# Altium project gest.PrjPcb
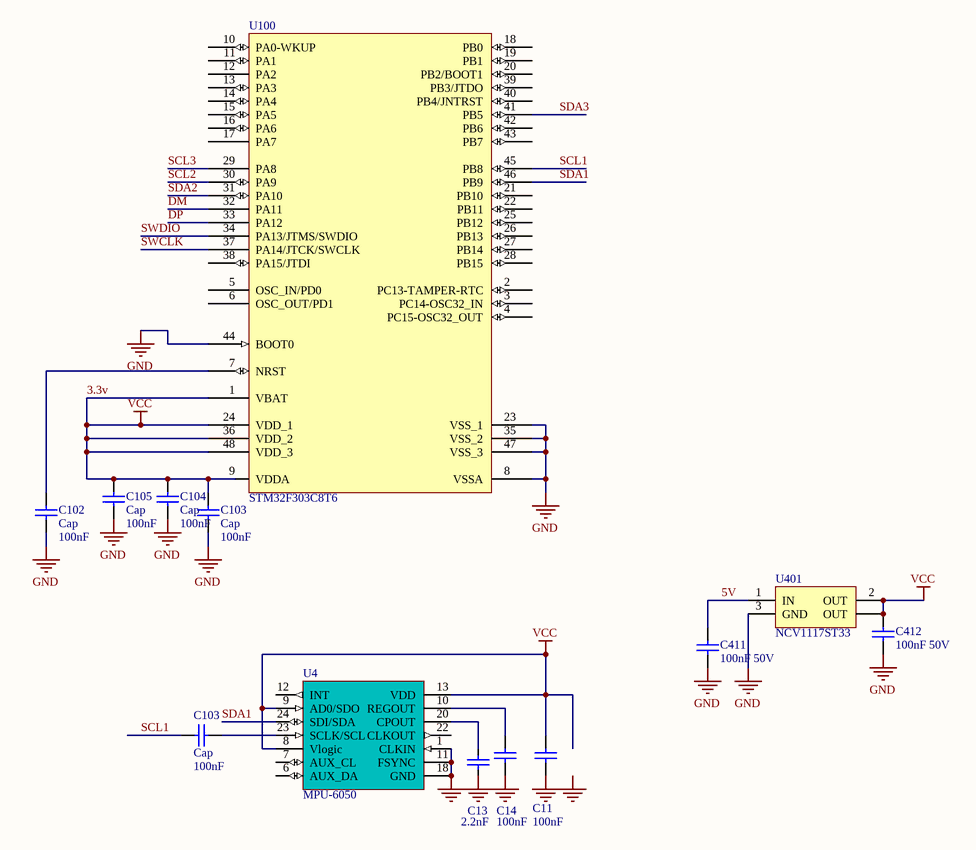
[diagram p0: gest.SchDoc]
1 sheet, 13 parts. Net scope: global (net labels, ports and power ports of the same name join across sheets).
Board file: gest.PcbDoc

## Sheet gest.SchDoc
size A4

### Parts
(Parts that share a designator on the sheet are numbered #1, #2 ... from top to bottom, then left to right.)
C11  value 100nF  [0402x]  (hidden comment: Cap402)
C13  value 2.2nF  [0402x]  (hidden comment: Cap603)
C14  value 100nF  [0603x]  (hidden comment: Cap402)
C102  Cap  value 100nF  [ERA-0603]
C103#1  Cap  value 100nF  [0603x]
C103#2  Cap  value 100nF  [0603x]
C104  Cap  value 100nF  [0603x]
C105  Cap  value 100nF  [0603x]
C411  100nF 50V  [0603x]
C412  100nF 50V  [0603x]
U4  MPU-6050  [IMU-3000]
U100  STM32F303C8T6  [LQFP48_N]
U401  NCV1117ST33  [sot23_l]

### Nets
3.3v: C11.2 C103#1.2 C104.2 C105.2 C412.1 U4.8(Vlogic) U4.9(AD0/SDO) U4.13(VDD) U100.1(VBAT) U100.9(VDDA) U100.24(VDD_1) U100.36(VDD_2) U100.48(VDD_3) U401.2(OUT) U401.?1(OUT)  [also labelled VCC]
GND: C11.1 C13.1 C14.2 C102.1 C103#1.1 C104.1 C105.1 C411.2 C412.2 U4.1(CLKIN) U4.11(FSYNC) U4.18(GND) U100.8(VSSA) U100.23(VSS_1) U100.35(VSS_2) U100.44(BOOT0) U100.47(VSS_3) U401.3(GND)
5V: C411.1 U401.1(IN)
DM: U100.32(PA11)
DP: U100.33(PA12)
SCL1: C103#2.2 U100.45(PB8)
SCL2: U100.30(PA9)
SCL3: U100.29(PA8)
SDA1: U4.24(SDI/SDA) U100.46(PB9)
SDA2: U100.31(PA10)
SDA3: U100.41(PB5)
SWCLK: U100.37(PA14/JTCK/SWCLK)
SWDIO: U100.34(PA13/JTMS/SWDIO)
NetC13_2: C13.2 U4.20(CPOUT)
NetC14_1: C14.1 U4.10(REGOUT)
NetC102_2: C102.2 U100.7(NRST)
NetC103#2_1: C103#2.1 U4.23(SCLK/SCL)

Not connected (* = marked no-connect by the designer): U4 2(NC) 3(NC) 4(NC) 5(NC) 6(AUX_DA) 7(AUX_CL) 12(INT) 14(NC) 15(NC) 16(NC) 17(NC) 19(RESV) 21(RESV) 22(CLKOUT); U100 2(PC13-TAMPER-RTC) 3(PC14-OSC32_IN) 4(PC15-OSC32_OUT) 5(OSC_IN/PD0) 6(OSC_OUT/PD1) 10(PA0-WKUP) 11(PA1) 12(PA2) 13(PA3) 14(PA4) 15(PA5) 16(PA6) 17(PA7) 18(PB0) 19(PB1) 20(PB2/BOOT1) 21(PB10) 22(PB11) 25(PB12) 26(PB13) 27(PB14) 28(PB15) 38(PA15/JTDI) 39(PB3/JTDO) 40(PB4/JNTRST) 42(PB6) 43(PB7)

### Notes on the sheet
- Labels drawn without touching a wire or pin: GND

### Library data of the parts
C11 C14 = Cap402: Capacitor SMD; Published: 1-Nov-2010; LatestRevisionDate: 1-Nov-2010; LatestRevisionNote: Released OpenPilot Lib; PackageReference: 0402 (1005 Metric); Publisher: The OpenPilot Project; ComponentLink2Description: Datasheet; Supplier 1: Digi-Key; Supplier Part Number 1: 445-4952-1-ND
C13 = Cap603: Capacitor SMD; Published: 1-Nov-2010; LatestRevisionDate: 1-Nov-2010; LatestRevisionNote: Released OpenPilot Lib; PackageReference: 0603 (1608 Metric); Publisher: The OpenPilot Project; Supplier 1: Digi-Key; Supplier Part Number 1: 445-1309-1-ND
C102 C103#1 C103#2 C104 C105 = Cap: Capacitor; Published: 8-Jun-2000; LatestRevisionDate: 17-Jul-2002; LatestRevisionNote: Re-released for DXP Platform.; PackageReference: RAD-0.3; Publisher: Altium Limited; PackageDescription: Radial Cap, Thru-Hole; 2 Leads; 0.3 in Pin Spacing
C411 C412 = Cap: Capacitor; Manufacturer: KEMET; Value: CAP CER 0.1UF 50V X7R 0603; Order number: C0603C104K5RACAUTO; Package: 0603; Cost: 0,1
U4 = MPU-6050: Invensense MPU-6050  3-axis Gyros & Accel; ComponentLink2Description: Datasheet; LatestRevisionDate: 1-Nov-2010; LatestRevisionNote: Released OpenPilot Lib; Published: 1-Nov-2010; Publisher: The OpenPilot Project; Manufacturer: Invensense; Supplier 1: Invensense; Supplier Part Number 1: MPU-6000
U100 = STM32F103C6T6: STM32 ARM-based 32-bit MCU with 32 Kbytes Flash, 48-pin LQFP, Industrial Temperature; Published: 30-May-2008; DatasheetVersion: rev6, Mar-2008; PackageVersion: Mar-2008; PackageReference: LQFP48; Publisher: Altium Limited; PackageDescription: 48-Pin Low-Profile Quad Flat Pack, 7 x 7 mm Body, 0.5 mm Pitch (LQFP48); ComponentLink1Description: Manufacturer Link; ComponentLink1URL: www.st.com/stm32; ComponentLink2Description: Datasheet; ComponentLink2URL: http://www.st.com/stonline/products/literature/ds/13587.pdf
U401 = REG1117-3.3: 800mA and 1A Low Dropout Positive Regulator 3.3V; Manufacturer: ON Semiconductor; Value: IC REG LINEAR 3.3V 1A SOT223; Order Number: NCV1117ST33T3G; Package: SOT223; Cost: 0,89